# Altium schematic sheet Ribbon_Connector_IO.SchDoc
size A4; SheetNumber: 4; SheetTotal: 5
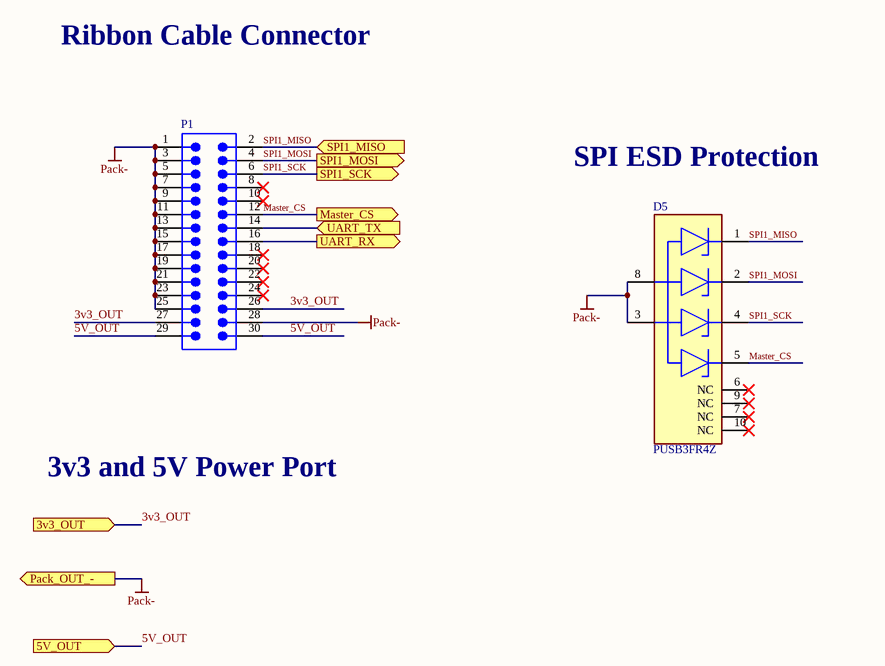
[diagram p0: Ribbon_Connector_IO.SchDoc]

## Parts
D5  PUSB3FR4Z  [FP-SOT1176-1-MFG]
P1  62703021721  [62703021721]  (value not drawn)

## Ports
3v3_OUT (in), 5V_OUT (in), Master_CS (out), Pack_OUT_- (out), SPI1_MISO (in), SPI1_MOSI (out), SPI1_SCK (out), UART_RX (out), UART_TX (in)

## Nets
Pack-: D5.3(GND) D5.8(GND) P1.1 P1.3 P1.5 P1.7 P1.9 P1.11 P1.13 P1.15 P1.17 P1.19 P1.21 P1.23 P1.25 P1.28 ; port Pack_OUT_-
3v3_OUT: P1.26 P1.27 ; port 3v3_OUT
5V_OUT: P1.29 P1.30 ; port 5V_OUT
Master_CS: D5.5(CH4) P1.12 ; port Master_CS
SPI1_MISO: D5.1(CH1) P1.2 ; port SPI1_MISO
SPI1_MOSI: D5.2(CH2) P1.4 ; port SPI1_MOSI
SPI1_SCK: D5.4(CH3) P1.6 ; port SPI1_SCK
UART_RX: P1.16 ; port UART_RX
UART_TX: P1.14 ; port UART_TX

Not connected (* = marked no-connect by the designer): D5 6(NC)* 7(NC)* 9(NC)* 10(NC)*; P1 8* 10* 18* 20* 22* 24*

## Notes on the sheet
- Ribbon Cable Connector
- SPI ESD Protection
- 3v3 and 5V Power Port

## Library data of the parts
D5 = CMP-14432-000005-1: TVS DIODE 3.3VWM 3VC DFN2510A-10; RoHS Compliant: Yes
P1 = CMP-03913-122639960-1: 62703021721 Conn, R/A Header, 30Pos, 2Row, 1.27Mm Rohs Compliant: Yes; Insulation Resistance: 1GΩ; Current Rating: 1A; Number of Pins: 30; Length: 23.82mm; Pitch: 1.27mm; Max Operating Temperature: 105°C; NexarPartId: 122639960; RoHS: Compliant; Min Operating Temperature: -40°C